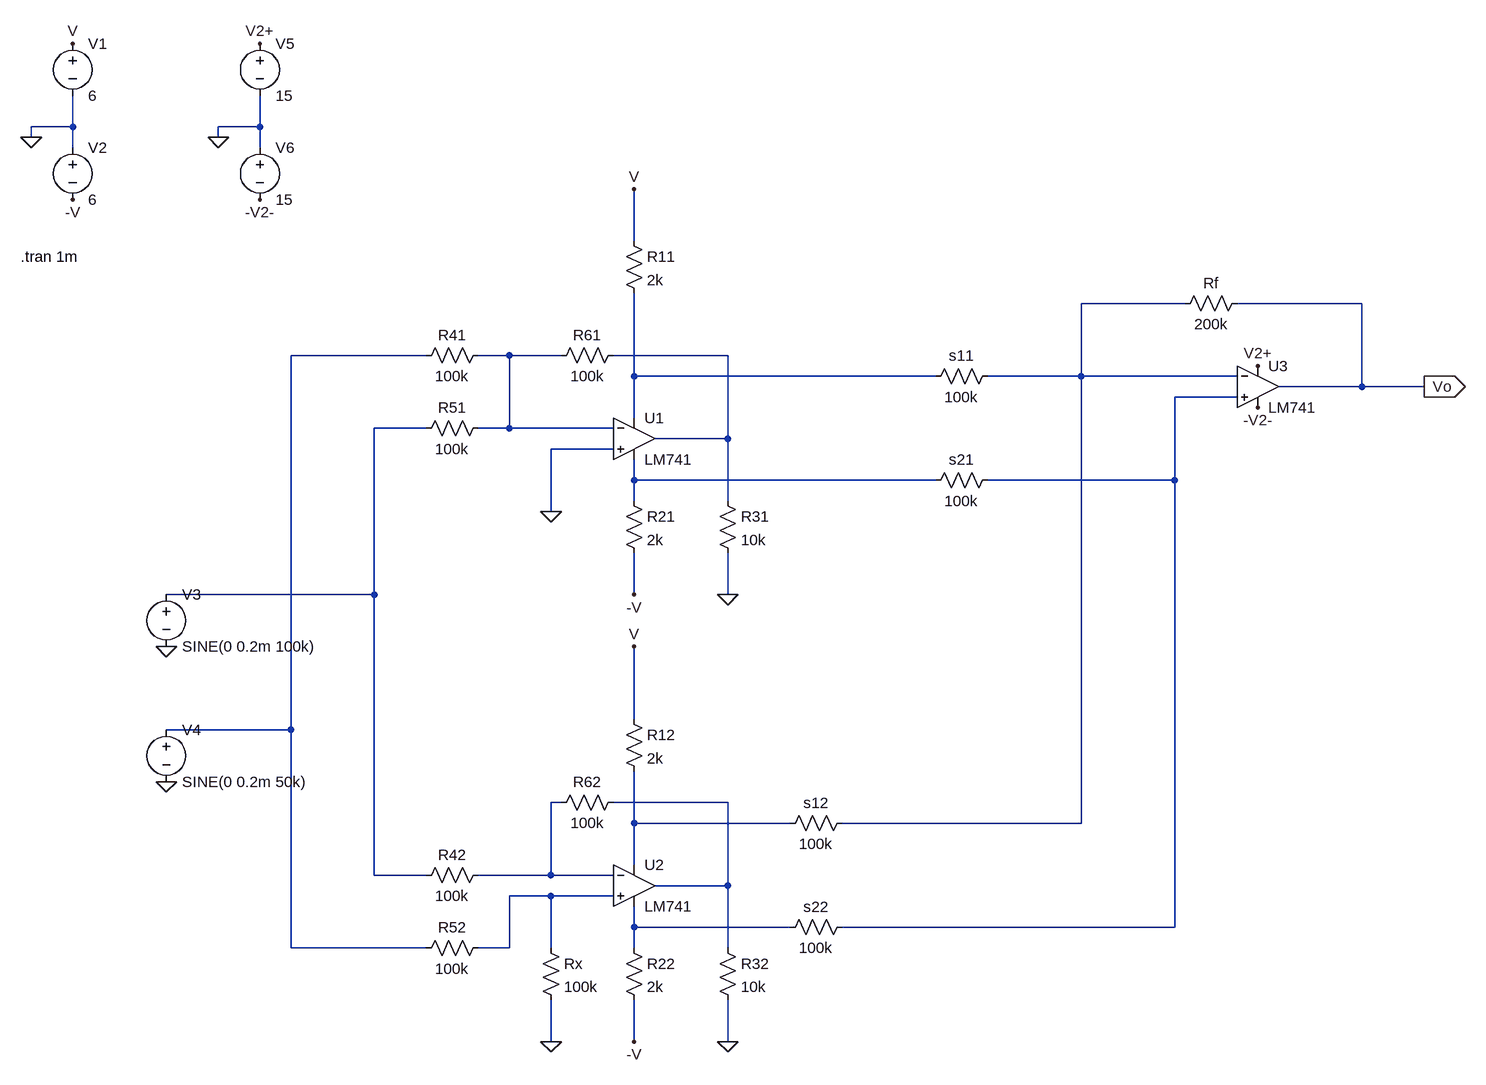
[diagram p0: schematic Opamp Multiplier V2.asc]
Opamp Multiplier V2.asc, the LTspice schematic file:
Version 4
SHEET 1 1944 1208
WIRE -224 -272 -224 -320
WIRE -224 -272 -288 -272
WIRE 64 -272 64 -320
WIRE 64 -272 0 -272
WIRE -288 -256 -288 -272
WIRE 0 -256 0 -272
WIRE -224 -240 -224 -272
WIRE 64 -240 64 -272
WIRE 640 -96 640 -176
WIRE 1488 0 1328 0
WIRE 1760 0 1568 0
WIRE 320 80 112 80
WIRE 448 80 400 80
WIRE 528 80 448 80
WIRE 784 80 608 80
WIRE 640 112 640 -16
WIRE 1104 112 640 112
WIRE 1328 112 1328 0
WIRE 1328 112 1184 112
WIRE 1568 112 1328 112
WIRE 1760 128 1760 0
WIRE 1760 128 1632 128
WIRE 1856 128 1760 128
WIRE 1568 144 1472 144
WIRE 640 176 640 112
WIRE 320 192 240 192
WIRE 448 192 448 80
WIRE 448 192 400 192
WIRE 608 192 448 192
WIRE 784 208 784 80
WIRE 784 208 672 208
WIRE 608 224 512 224
WIRE 640 272 640 240
WIRE 1104 272 640 272
WIRE 1472 272 1472 144
WIRE 1472 272 1184 272
WIRE 640 304 640 272
WIRE 784 304 784 208
WIRE 512 320 512 224
WIRE 240 448 240 192
WIRE 240 448 -80 448
WIRE 640 448 640 384
WIRE 784 448 784 384
WIRE 640 640 640 528
WIRE 112 656 112 80
WIRE 112 656 -80 656
WIRE 528 768 512 768
WIRE 784 768 608 768
WIRE 640 800 640 720
WIRE 880 800 640 800
WIRE 1328 800 1328 112
WIRE 1328 800 960 800
WIRE 640 864 640 800
WIRE 240 880 240 448
WIRE 320 880 240 880
WIRE 512 880 512 768
WIRE 512 880 400 880
WIRE 608 880 512 880
WIRE 784 896 784 768
WIRE 784 896 672 896
WIRE 512 912 448 912
WIRE 608 912 512 912
WIRE 640 960 640 928
WIRE 880 960 640 960
WIRE 1472 960 1472 272
WIRE 1472 960 960 960
WIRE 112 992 112 656
WIRE 320 992 112 992
WIRE 448 992 448 912
WIRE 448 992 400 992
WIRE 512 992 512 912
WIRE 640 992 640 960
WIRE 784 992 784 896
WIRE 512 1136 512 1072
WIRE 640 1136 640 1072
WIRE 784 1136 784 1072
FLAG -288 -256 0
FLAG -224 -400 V
FLAG -224 -160 -V
FLAG 512 320 0
FLAG 512 1136 0
FLAG 640 528 V
FLAG 640 1136 -V
FLAG 784 1136 0
FLAG 640 448 -V
FLAG 640 -176 V
FLAG 784 448 0
FLAG 1856 128 Vo
IOPIN 1856 128 Out
FLAG -80 528 0
FLAG -80 736 0
FLAG 0 -256 0
FLAG 64 -160 -V2-
FLAG 64 -400 V2+
FLAG 1600 96 V2+
FLAG 1600 160 -V2-
SYMBOL voltage -224 -416 R0
WINDOW 123 0 0 Left 0
WINDOW 39 0 0 Left 0
SYMATTR InstName V1
SYMATTR Value 6
SYMBOL voltage -224 -256 R0
WINDOW 123 0 0 Left 0
WINDOW 39 0 0 Left 0
SYMATTR InstName V2
SYMATTR Value 6
SYMBOL OpAmps\\LM741 640 144 R0
SYMATTR InstName U1
SYMBOL OpAmps\\LM741 640 832 R0
SYMATTR InstName U2
SYMBOL res 416 176 R90
WINDOW 0 0 56 VBottom 2
WINDOW 3 32 56 VTop 2
SYMATTR InstName R51
SYMATTR Value 100k
SYMATTR SpiceLine tol=1
SYMBOL res 416 864 R90
WINDOW 0 0 56 VBottom 2
WINDOW 3 32 56 VTop 2
SYMATTR InstName R42
SYMATTR Value 100k
SYMATTR SpiceLine tol=1
SYMBOL res 416 64 R90
WINDOW 0 0 56 VBottom 2
WINDOW 3 32 56 VTop 2
SYMATTR InstName R41
SYMATTR Value 100k
SYMATTR SpiceLine tol=1
SYMBOL res 416 976 R90
WINDOW 0 0 56 VBottom 2
WINDOW 3 32 56 VTop 2
SYMATTR InstName R52
SYMATTR Value 100k
SYMATTR SpiceLine tol=1
SYMBOL res 496 976 R0
SYMATTR InstName Rx
SYMATTR Value 100k
SYMATTR SpiceLine tol=1
SYMBOL res 624 752 R90
WINDOW 0 0 56 VBottom 2
WINDOW 3 32 56 VTop 2
SYMATTR InstName R62
SYMATTR Value 100k
SYMATTR SpiceLine tol=1
SYMBOL res 624 624 R0
SYMATTR InstName R12
SYMATTR Value 2k
SYMATTR SpiceLine tol=1
SYMBOL res 624 976 R0
SYMATTR InstName R22
SYMATTR Value 2k
SYMATTR SpiceLine tol=1
SYMBOL res 768 976 R0
SYMATTR InstName R32
SYMATTR Value 10k
SYMATTR SpiceLine tol=1
SYMBOL res 976 944 R90
WINDOW 0 0 56 VBottom 2
WINDOW 3 32 56 VTop 2
SYMATTR InstName s22
SYMATTR Value 100k
SYMATTR SpiceLine tol=1
SYMBOL res 976 784 R90
WINDOW 0 0 56 VBottom 2
WINDOW 3 32 56 VTop 2
SYMATTR InstName s12
SYMATTR Value 100k
SYMATTR SpiceLine tol=1
SYMBOL res 624 64 R90
WINDOW 0 0 56 VBottom 2
WINDOW 3 32 56 VTop 2
SYMATTR InstName R61
SYMATTR Value 100k
SYMATTR SpiceLine tol=1
SYMBOL res 624 -112 R0
SYMATTR InstName R11
SYMATTR Value 2k
SYMATTR SpiceLine tol=1
SYMBOL res 624 288 R0
SYMATTR InstName R21
SYMATTR Value 2k
SYMATTR SpiceLine tol=1
SYMBOL res 768 288 R0
SYMATTR InstName R31
SYMATTR Value 10k
SYMATTR SpiceLine tol=1
SYMBOL res 1200 96 R90
WINDOW 0 0 56 VBottom 2
WINDOW 3 32 56 VTop 2
SYMATTR InstName s11
SYMATTR Value 100k
SYMATTR SpiceLine tol=1
SYMBOL res 1200 256 R90
WINDOW 0 0 56 VBottom 2
WINDOW 3 32 56 VTop 2
SYMATTR InstName s21
SYMATTR Value 100k
SYMATTR SpiceLine tol=1
SYMBOL OpAmps\\LM741 1600 64 R0
SYMATTR InstName U3
SYMBOL res 1584 -16 R90
WINDOW 0 0 56 VBottom 2
WINDOW 3 32 56 VTop 2
SYMATTR InstName Rf
SYMATTR Value 200k
SYMATTR SpiceLine tol=1
SYMBOL voltage -80 432 R0
WINDOW 123 0 0 Left 0
WINDOW 39 0 0 Left 0
SYMATTR InstName V3
SYMATTR Value SINE(0 0.2m 100k)
SYMBOL voltage -80 640 R0
WINDOW 123 0 0 Left 0
WINDOW 39 0 0 Left 0
SYMATTR InstName V4
SYMATTR Value SINE(0 0.2m 50k)
SYMBOL voltage 64 -416 R0
WINDOW 123 0 0 Left 0
WINDOW 39 0 0 Left 0
SYMATTR InstName V5
SYMATTR Value 15
SYMBOL voltage 64 -256 R0
WINDOW 123 0 0 Left 0
WINDOW 39 0 0 Left 0
SYMATTR InstName V6
SYMATTR Value 15
TEXT -304 -72 Left 2 !.tran 1m

The netlist it stands for:
* Opamp Multiplier V2.asc
V1 V 0 6
V2 0 -V 6
XU1 0 N003 N005 N008 N004 LM741  ; pins In+ In- V+ V- OUT
XU2 N012 N009 N011 N013 N010 LM741  ; pins In+ In- V+ V- OUT
R51 N003 N007 100k tol=1
R42 N009 N007 100k tol=1
R41 N003 N002 100k tol=1
R52 N012 N002 100k tol=1
Rx N012 0 100k tol=1
R62 N010 N009 100k tol=1
R12 V N011 2k tol=1
R22 N013 -V 2k tol=1
R32 N010 0 10k tol=1
R§s22 N006 N013 100k tol=1
R§s12 N001 N011 100k tol=1
R61 N004 N003 100k tol=1
R11 V N005 2k tol=1
R21 N008 -V 2k tol=1
R31 N004 0 10k tol=1
R§s11 N001 N005 100k tol=1
R§s21 N006 N008 100k tol=1
XU3 N006 N001 V2+ -V2- Vo LM741  ; pins In+ In- V+ V- OUT
Rf Vo N001 200k tol=1
V3 N007 0 SINE(0 0.2m 100k)
V4 N002 0 SINE(0 0.2m 50k)
V5 V2+ 0 15
V6 0 -V2- 15
.tran 1m
.lib LM741.lib
.backanno
.end